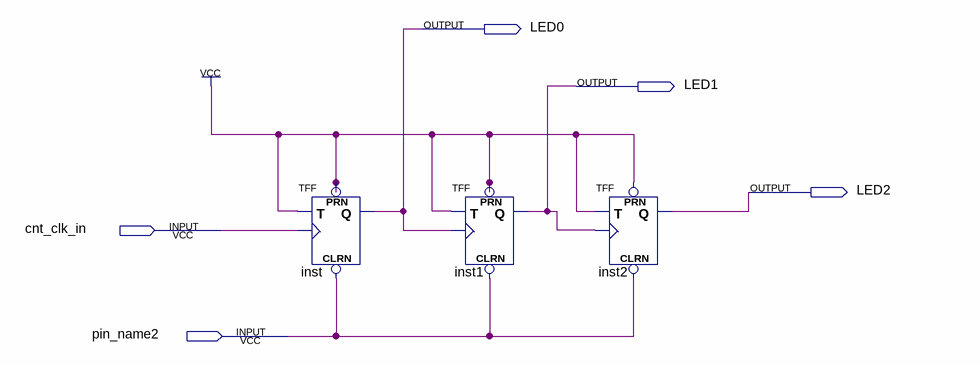
[diagram p0: schematic sheet]
// Quartus schematic counter_3bit.bdf as structural Verilog: 3 symbols, 5 pins
module counter_3bit (
  input  cnt_clk_in,
  input  pin_name2,
  output LED0,
  output LED1,
  output LED2
);

  TFF inst (.PRN(1'b1), .CLRN(pin_name2), .T(1'b1), .CLK(cnt_clk_in), .Q(LED0));
  TFF inst1 (.PRN(1'b1), .CLRN(pin_name2), .T(1'b1), .CLK(LED0), .Q(LED1));
  TFF inst2 (.PRN(1'b1), .CLRN(pin_name2), .T(1'b1), .CLK(LED1), .Q(LED2));
endmodule
